# Altium schematic sheet 6_CODEC.SchDoc
size A4; SheetNumber: 6; SheetTotal: 7
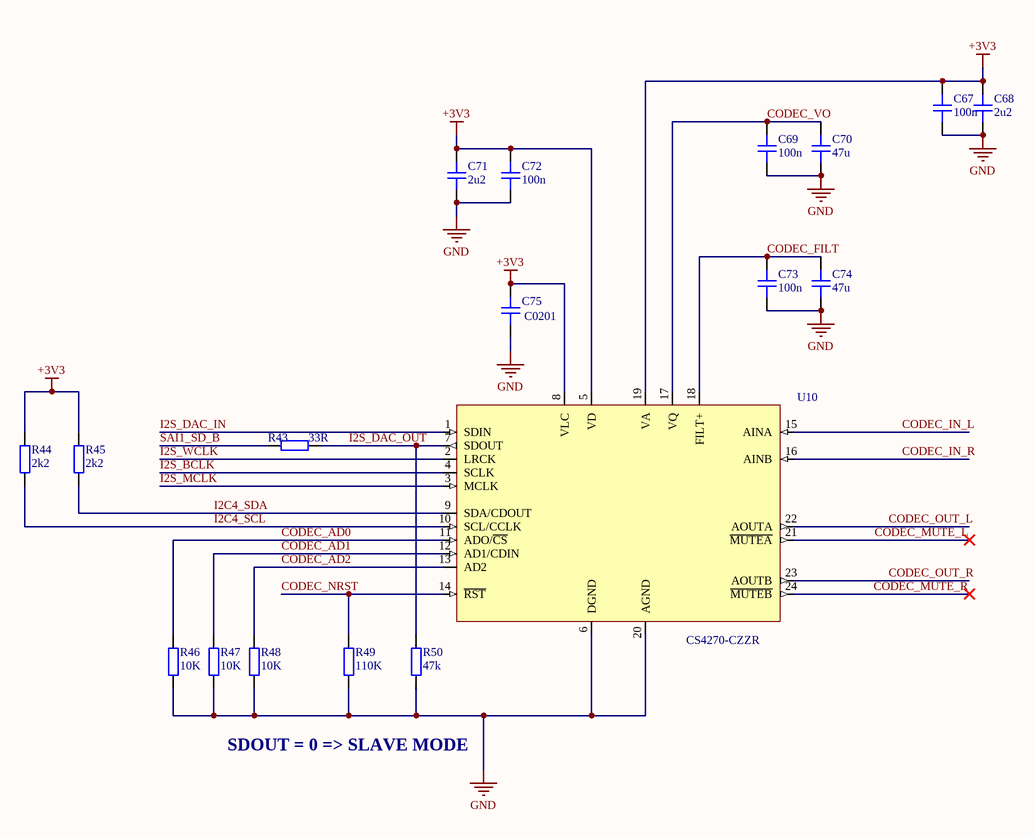
[diagram p0: 6_CODEC.SchDoc]

## Parts
C67  100n  [CAP_0201]
C68  2u2  [CAP_0201]
C69  100n  [CAP_0201]
C70  47u  [CAP_0201]
C71  2u2  [CAP_0201]
C72  100n  [CAP_0201]
C73  100n  [CAP_0201]
C74  47u  [CAP_0201]
C75  C0201  [CAP_0201]
R43  33R  [RES_0402]
R44  2k2  [RES_0402]
R45  2k2  [RES_0402]
R46  10K  [RES_0402]
R47  10K  [RES_0402]
R48  10K  [RES_0402]
R49  110K  [RES_0402]
R50  47k  [RES_0402]
U10  CS4270-CZZR  [TSSOP-24]

## Nets
+3V3: C67.2 C68.2 C71.2 C72.2 C75.2 R44.1 R45.1 U10.5(VD) U10.8(VLC) U10.19(VA)
GND: C67.1 C68.1 C69.1 C70.1 C71.1 C72.1 C73.1 C74.1 C75.1 R46.1 R47.1 R48.1 R49.1 R50.1 U10.6(DGND) U10.20(AGND)
CODEC_AD0: R46.2 U10.11(ADO/~{CS})
CODEC_AD1: R47.2 U10.12(AD1/CDIN)
CODEC_AD2: R48.2 U10.13(AD2)
CODEC_FILT: C73.2 C74.2 U10.18(FILT+)
CODEC_IN_L: U10.15(AINA)
CODEC_IN_R: U10.16(AINB)
CODEC_MUTE_L: U10.21(~{MUTEA})
CODEC_MUTE_R: U10.24(~{MUTEB})
CODEC_NRST: R49.2 U10.14(~{RST})
CODEC_OUT_L: U10.22(AOUTA)
CODEC_OUT_R: U10.23(AOUTB)
CODEC_VO: C69.2 C70.2 U10.17(VQ)
I2C4_SCL: R44.2 U10.10(SCL/CCLK)
I2C4_SDA: R45.2 U10.9(SDA/CDOUT)
I2S_BCLK: U10.4(SCLK)
I2S_DAC_IN: U10.1(SDIN)
I2S_DAC_OUT: R43.1 R50.2 U10.7(SDOUT)
I2S_MCLK: U10.3(MCLK)
I2S_WCLK: U10.2(LRCK)
SAI1_SD_B: R43.2

## Notes on the sheet
- SDOUT = 0 => SLAVE MODE

## Library data of the parts
C67-C75 = CAP_0201: Capacitor SMD 0201; Manufacturer: *; Manufacturer Part Number: *; Distributor Link: *; LCSC: *; Rating: *; Dielectric: *
R43-R50 = RES_0402: Resistor SMD 0402; Manufacturer: *; Manufacturer Part Number: *; Distributor Link: *; LCSC: *
U10 = CS4270-CZZR: 24-Bit 192kHz Stereo Audio Codec TSSOP-24; Manufacturer: Cirrus Logic; Manufacturer Part Number: CS4270-CZZR